# Altium project eCore_V2.PrjPcb
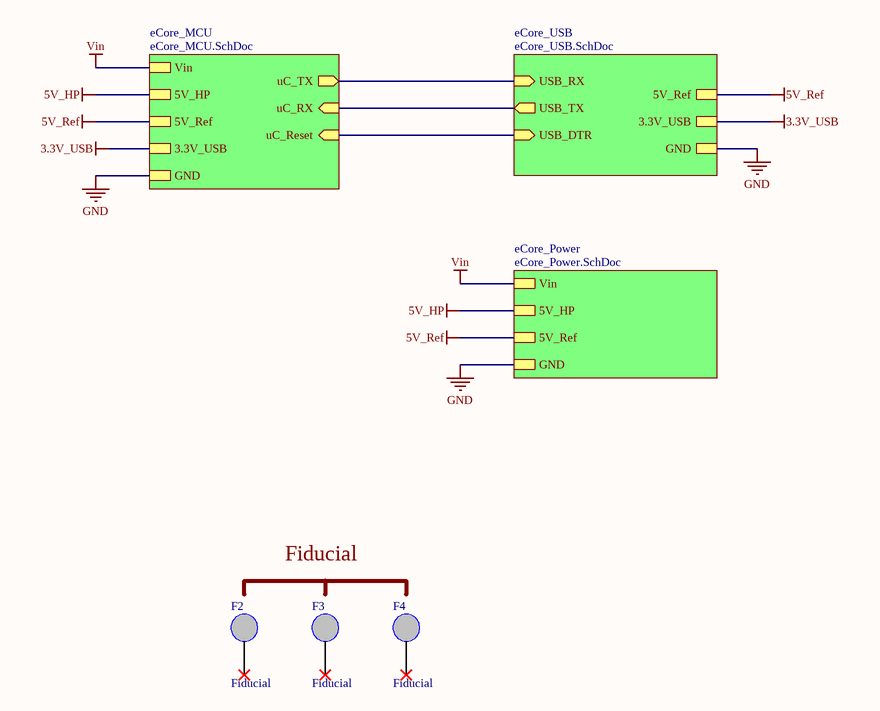
[diagram p0: eCore_Main.SchDoc]
4 sheets, 52 parts. Net scope: hierarchical (ports join the sheet entries above them; power ports are global).
Board file: PCB_eCore.PcbDoc
Sheets:
  eCore_Main.SchDoc
    eCore_MCU = eCore_MCU.SchDoc
    eCore_Power = eCore_Power.SchDoc
    eCore_USB = eCore_USB.SchDoc

## Sheet eCore_Main.SchDoc
size A

### Parts
F2  Fiducial  [Fiducial]
F3  Fiducial  [Fiducial]
F4  Fiducial  [Fiducial]

### Sub-sheets
eCore_MCU = eCore_MCU.SchDoc: Vin, 5V_HP, 5V_Ref, 3.3V_USB, uC_RX (in), uC_TX (out), uC_Reset (in), GND
eCore_Power = eCore_Power.SchDoc: 5V_HP, 5V_Ref, Vin, GND
eCore_USB = eCore_USB.SchDoc: USB_RX (in), USB_TX (out), USB_DTR (in), 5V_Ref, GND, 3.3V_USB

### Nets
3.3V_USB: sheet eCore_MCU/3.3V_USB, sheet eCore_USB/3.3V_USB
5V_HP: sheet eCore_MCU/5V_HP, sheet eCore_Power/5V_HP
5V_Ref: sheet eCore_MCU/5V_Ref, sheet eCore_Power/5V_Ref, sheet eCore_USB/5V_Ref
GND: sheet eCore_MCU/GND, sheet eCore_Power/GND, sheet eCore_USB/GND
Vin: sheet eCore_MCU/Vin, sheet eCore_Power/Vin
D0: sheet eCore_MCU/uC_RX, sheet eCore_USB/USB_TX
D1: sheet eCore_MCU/uC_TX, sheet eCore_USB/USB_RX
uC_Reset: sheet eCore_MCU/uC_Reset, sheet eCore_USB/USB_DTR

Not connected (* = marked no-connect by the designer): F2 Fiducial*; F3 Fiducial*; F4 Fiducial*

### Notes on the sheet
- Fiducial

## Sheet eCore_MCU.SchDoc
size A4
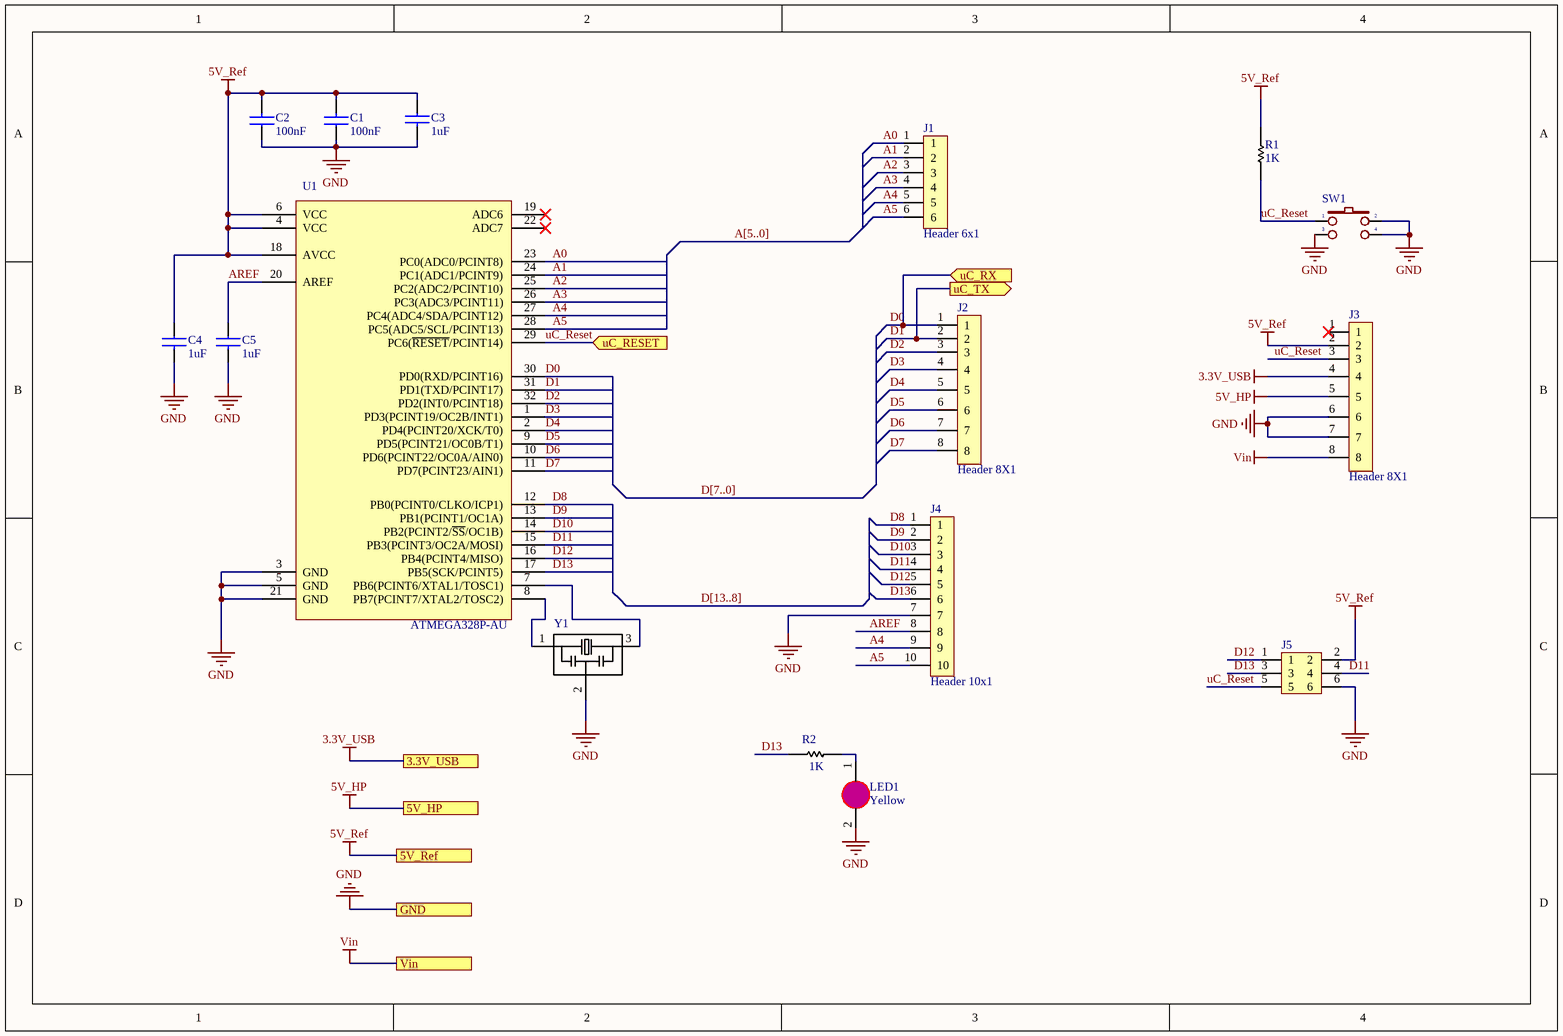
[diagram p1: eCore_MCU.SchDoc]

### Parts
C1  100nF  [CAPC1005X60N]
C2  100nF  [CAPC1005X60N]
C3  1uF  [C0603]
C4  1uF  [CAPC1005X60N]
C5  1uF  [CAPC1005X60N]
J1  Header 6x1  [1x6 Socket Heder 2.54mm]
J2  Header 8X1  [1x8 Socket Heder 2.54mm]
J3  Header 8X1  [1x8 Socket Heder 2.54mm]
J4  Header 10x1  [1x10 Socket Header 2.54mm]
J5  Header 3x2  [HEADER 3X3]  (value not drawn)
LED1  Yellow  [LEDY-0402]
R1  1K  [RES 0402 SMD]
R2  1K  [RES 0402 SMD]
SW1  SW2-SMD  [SW-SMD]  (value not drawn)
U1  ATMEGA328P-AU  [QFP80P900X900X120-32N]
Y1  CSTCE16M0V53-R0  [OSC_CSTCE16M0V53-R0]  (value not drawn)

### Ports
3.3V_USB, 5V_HP, 5V_Ref, GND, uC_RESET (in), uC_RX (in), uC_TX (out), Vin

### Nets
3.3V_USB: J3.4 ; port 3.3V_USB
5V_HP: J3.5 ; port 5V_HP
5V_Ref: C1.2 C2.2 C3.1 C4.1 J3.2 J5.2 R1.2 U1.4(VCC) U1.6(VCC) U1.18(AVCC) ; port 5V_Ref
GND: C1.1 C2.1 C3.2 C4.2 C5.2 J3.6 J3.7 J4.7 J5.6 LED1.2(K) SW1.2 SW1.S1 SW1.S2 U1.3(GND) U1.5(GND) U1.21(GND) Y1.2 ; port GND
Vin: J3.8 ; port Vin
A0: J1.1 U1.23(PC0(ADC0/PCINT8))
A1: J1.2 U1.24(PC1(ADC1/PCINT9))
A2: J1.3 U1.25(PC2(ADC2/PCINT10))
A3: J1.4 U1.26(PC3(ADC3/PCINT11))
A4: J1.5 J4.9 U1.27(PC4(ADC4/SDA/PCINT12))
A5: J1.6 J4.10 U1.28(PC5(ADC5/SCL/PCINT13))
AREF: C5.1 J4.8 U1.20(AREF)
D0: J2.1 U1.30(PD0(RXD/PCINT16)) ; port uC_RX
D1: J2.2 U1.31(PD1(TXD/PCINT17)) ; port uC_TX
D2: J2.3 U1.32(PD2(INT0/PCINT18))
D3: J2.4 U1.1(PD3(PCINT19/OC2B/INT1))
D4: J2.5 U1.2(PD4(PCINT20/XCK/T0))
D5: J2.6 U1.9(PD5(PCINT21/OC0B/T1))
D6: J2.7 U1.10(PD6(PCINT22/OC0A/AIN0))
D7: J2.8 U1.11(PD7(PCINT23/AIN1))
D8: J4.1 U1.12(PB0(PCINT0/CLKO/ICP1))
D9: J4.2 U1.13(PB1(PCINT1/OC1A))
D10: J4.3 U1.14(PB2(PCINT2/~{SS}/OC1B))
D11: J4.4 J5.4 U1.15(PB3(PCINT3/OC2A/MOSI))
D12: J4.5 J5.1 U1.16(PB4(PCINT4/MISO))
D13: J4.6 J5.3 R2.1 U1.17(PB5(SCK/PCINT5))
uC_Reset: J3.3 J5.5 R1.1 SW1.1 U1.29(PC6(~{RESET}/PCINT14)) ; port uC_RESET
NetLED1_1: LED1.1(A) R2.2
NetU1_7: U1.7(PB6(PCINT6/XTAL1/TOSC1)) Y1.3
NetU1_8: U1.8(PB7(PCINT7/XTAL2/TOSC2)) Y1.1

Not connected (* = marked no-connect by the designer): J3 1*; U1 19(ADC6)* 22(ADC7)*

### Buses and harness runs
bus A[5..0]
bus D[7..0]
bus D[13..8]

### Notes on the sheet
- (in symbol SW2-SMD) 3; 4

### Library data of the parts
C1 C2 C4 C5 = Cap 0402
C3 = Cap 0603: Right: 20; Bottom: 10
LED1 = LEDSMD: LED 3mm
R1 R2 = Res 0402: Resistor; Manufacturer: Generic Components; Class: Passive; Published: 08/06/2000; Publisher: Altium Hobart Technology Centre; SubClass: Resistor
SW1 = SW2-SMD: Switch button 2 pin; Value: SW chip 2 pin
U1 = ATMEGA328P-AU: ATmega Series 20 MHz 32 KB Flash 2 KB SRAM 8-Bit Microcontroller - TQFP-32; MF: Atmel; Price: 2.38 USD; Availability: Good; MP: ATMEGA328P-AU; Package: TQFP-32 Atmel; Value: *
Y1 = XTAL-CSTCE16M0V53-R0: Ceramic Resonator 16MHz ??0.5% (Tol) ??0.3% (Stability) 15pF 40Ohm 3-Pin CSMD T/R; MF: Murata; MP: CSTCE16M0V53-R0; Availability: Good; Package: SMD-3 Murata; Price: 0.29 USD; Value: *

## Sheet eCore_Power.SchDoc
size A
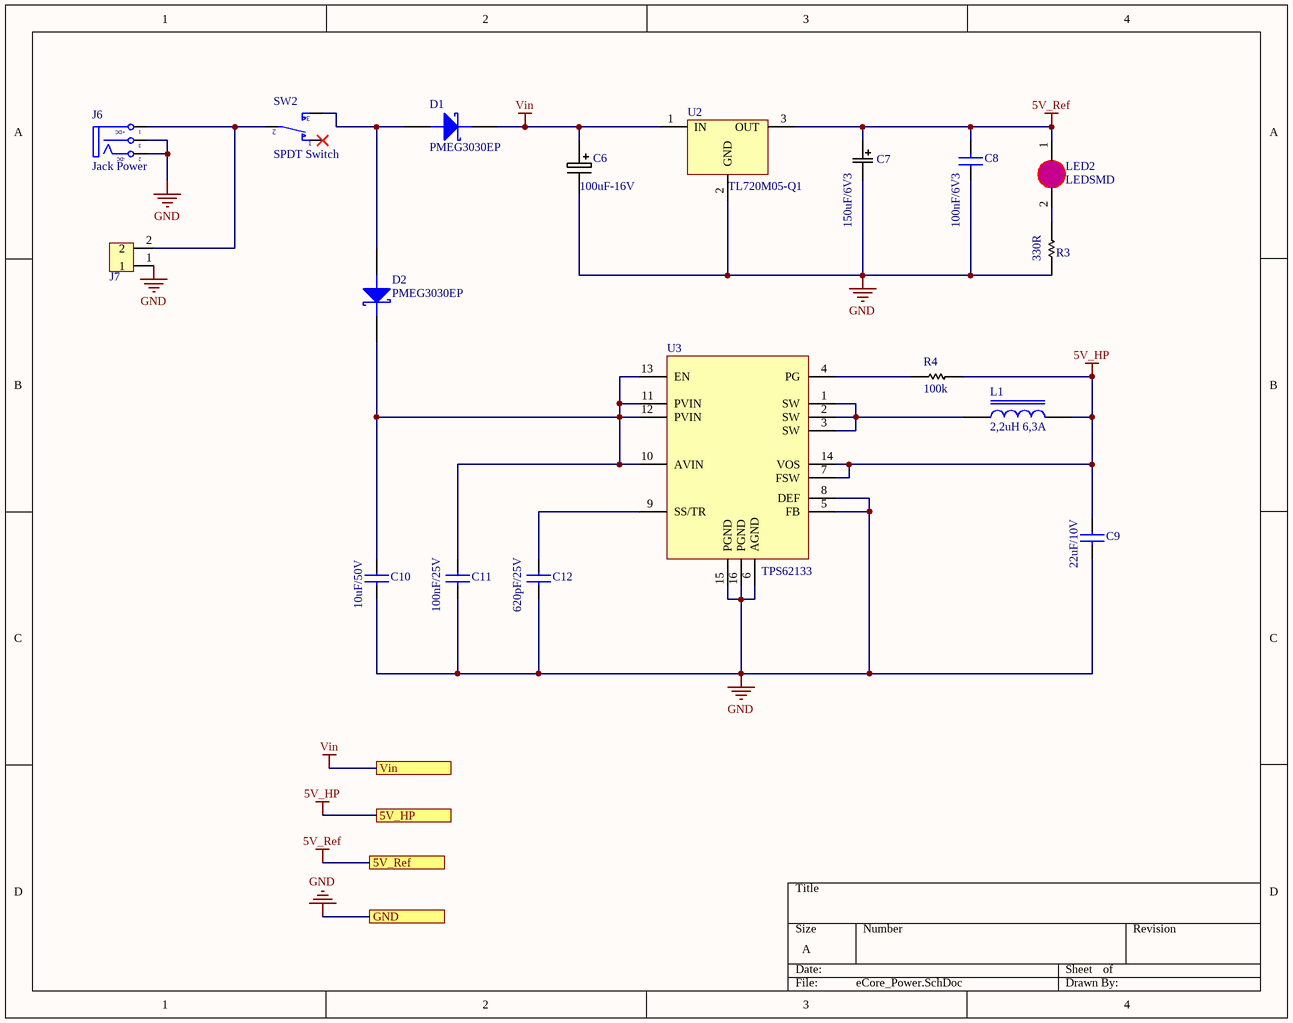
[diagram p2: eCore_Power.SchDoc]

### Parts
C6  100uF-16V  [PANACAP-D-GENERIC]
C7  150uF/6V3  [CASE_B_3528_1411]
C8  100nF/6V3  [CAPC1005X60N]
C9  22uF/10V  [C1206]
C10  10uF/50V  [C1206]
C11  100nF/25V  [C0603]
C12  620pF/25V  [C0603]
D1  PMEG3030EP  [SOD128]
D2  PMEG3030EP  [SOD128]
J6  Jack Power  [DC-IN]
J7  Header 2x1  [2P ZH1.5MM]  (value not drawn)
L1  2,2uH 6,3A  [SRN8040]
LED2  LEDSMD  [LEDR-0402]
R3  330R  [RES 0402 SMD]
R4  100k  [RES 0402 SMD]
SW2  SPDT Switch  [Slide Switch SPDT]
U2  TL720M05-Q1  [TO-252]
U3  TPS62133  [QFN16]

### Ports
5V_HP, 5V_Ref, GND, Vin

### Nets
5V_HP: C9.1 L1.2 R4.1 U3.7(FSW) U3.14(VOS) ; port 5V_HP
5V_Ref: C7.1(C1) C8.2 LED2.1(A) U2.3(OUT) ; port 5V_Ref
GND: C6.- C7.2(C2) C8.1 C9.2 C10.2 C11.2 C12.2 J6.2(TN) J6.3(S) J7.1 R3.2 U2.2(GND) U3.5(FB) U3.6(AGND) U3.8(DEF) U3.15(PGND) U3.16(PGND) ; port GND
Vin: C6.+ D1.K U2.1(IN) ; port Vin
NetC10_1: C10.1 C11.1 D2.K U3.10(AVIN) U3.11(PVIN) U3.12(PVIN) U3.13(EN)
NetC12_1: C12.1 U3.9(SS/TR)
NetD1_A: D1.A D2.A SW2.3
NetJ6_1: J6.1(T) J7.2 SW2.2
NetL1_1: L1.1 U3.1(SW) U3.2(SW) U3.3(SW)
NetLED2_2: LED2.2(K) R3.1
NetR4_2: R4.2 U3.4(PG)

Not connected (* = marked no-connect by the designer): SW2 1*

### Notes on the sheet
- (in symbol Jack Power) +DC; -DC

### Library data of the parts
C6 = PANACAP-100UF-16V-FK: GENERIC CAPACITOR POLARISED; Supplier 1: Digi-Key; Supplier Part Number 1: PCE3783TR-ND
C7 = Cap CASE B
C8 = Cap 0402
C9 C10 = Cap 1206: Right: 20; Bottom: 10
C11 C12 = Cap 0603: Right: 20; Bottom: 10
J6 = Jack Power: Jac DC input; Value: Jac DC
L1 = Inductor SMD
LED2 = LEDSMD: LED 3mm
R3 R4 = Res 0402: as R1 on sheet eCore_MCU; Published: 08/06/2000; Publisher: Altium Hobart Technology Centre; SubClass: Resistor

## Sheet eCore_USB.SchDoc
size A
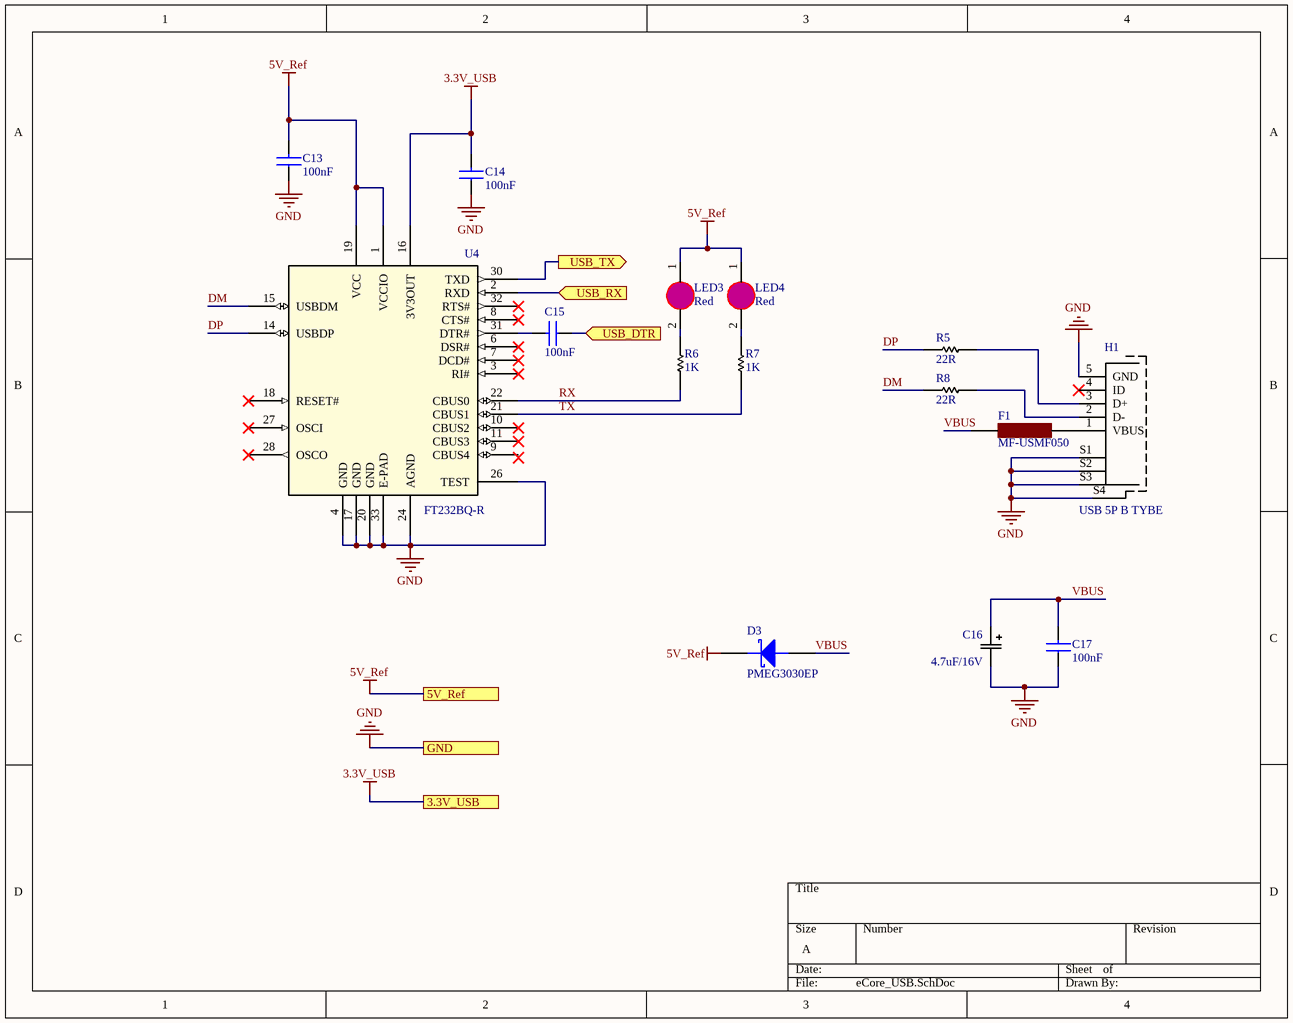
[diagram p3: eCore_USB.SchDoc]

### Parts
C13  100nF  [CAPC1005X60N]
C14  100nF  [CAPC1005X60N]
C15  100nF  [CAPC1005X60N]
C16  4.7uF/16V  [CAPCP3216X180N]
C17  100nF  [CAPC1005X60N]
D3  PMEG3030EP  [SOD128]
F1  MF-USMF050  [Fuse MF-USMF050]
H1  USB 5P B TYBE  [USB 5P B TYPE]
LED3  Red  [LEDR-0402]
LED4  Red  [LEDR-0402]
R5  22R  [RES 0402 SMD]
R6  1K  [RES 0402 SMD]
R7  1K  [RES 0402 SMD]
R8  22R  [RES 0402 SMD]
U4  FT232BQ-R  [QFN_FTDI5X5]

### Ports
3.3V_USB, 5V_Ref, GND, USB_DTR (in), USB_RX (in), USB_TX (out)

### Nets
3.3V_USB: C14.2 U4.16(3V3OUT) ; port 3.3V_USB
5V_Ref: C13.2 D3.K LED3.1(A) LED4.1(A) U4.1(VCCIO) U4.19(VCC) ; port 5V_Ref
GND: C13.1 C14.1 C16.2(C2) C17.1 H1.5 H1.S1 H1.S2 H1.S3 H1.S4 U4.4(GND) U4.17(GND) U4.20(GND) U4.24(AGND) U4.26(TEST) U4.33(E-PAD) ; port GND
D0: U4.30(TXD) ; port USB_TX
D1: U4.2(RXD) ; port USB_RX
DM: R8.1 U4.15(USBDM)
DP: R5.1 U4.14(USBDP)
RX: R6.1 U4.22(CBUS0)
TX: R7.1 U4.21(CBUS1)
uC_Reset: C15.1 ; port USB_DTR
VBUS: C16.1(C1) C17.2 D3.A F1.1
NetC15_2: C15.2 U4.31(DTR#)
NetF1_2: F1.2 H1.1(VBUS)
NetH1_2: H1.2(D-) R8.2
NetH1_3: H1.3(D+) R5.2
NetLED3_2: LED3.2(K) R6.2
NetLED4_2: LED4.2(K) R7.2

Not connected (* = marked no-connect by the designer): H1 4(ID)* 6; U4 3(RI#)* 5(NC) 6(DSR#)* 7(DCD#)* 8(CTS#)* 9(CBUS4) 10(CBUS2)* 11(CBUS3)* 12(NC) 13(NC) 18(RESET#)* 23(NC) 25(NC) 27(OSCI)* 28(OSCO)* 29(NC) 32(RTS#)*

### Library data of the parts
C13-C15 C17 = Cap 0402
C16 = CAP Tantalum Case A: Cap Tant Solid 4.7uF 16V A CASE 10% (3.2 X 1.6 X 1.6mm) SMD 3216-18 2.9 Ohm 175C Automotive T/R; MP: THJA475K016RJN; MF: AVX; Availability: Good; Price: 0.27 USD; Package: 1206 AVX; Value: *
H1 = USB 5P B TYBE: USB conector
LED3 LED4 = LEDSMD: LED 3mm
R5-R8 = Res 0402: as R1 on sheet eCore_MCU; Published: 08/06/2000; Publisher: Altium Hobart Technology Centre; SubClass: Resistor
U4 = FT232BQ-R: Imported; Manufacturer_Part_Number: FT232BQ-REEL; Vendor: FTDI, Future Technology Devices International Ltd; Built_By: EMA_UL_Team; C: Copyright (C) 2016 Accelerated Designs. All rights reserved; Value: Value; Type: Type; RefDes: RefDes

## Nets that join several sheets
3.3V_USB: eCore_MCU (J3.4), eCore_USB (C14.2 U4.16)
5V_HP: eCore_MCU (J3.5), eCore_Power (5 pins)
5V_Ref: eCore_MCU (10 pins), eCore_Power (C7.1 C8.2 LED2.1 U2.3), eCore_USB (6 pins)
GND: eCore_MCU (17 pins), eCore_Power (17 pins), eCore_USB (15 pins)
Vin: eCore_MCU (J3.8), eCore_Power (C6.+ D1.K U2.1)
D0: eCore_MCU (J2.1 U1.30), eCore_USB (U4.30)
D1: eCore_MCU (J2.2 U1.31), eCore_USB (U4.2)
uC_Reset: eCore_MCU (5 pins), eCore_USB (C15.1)